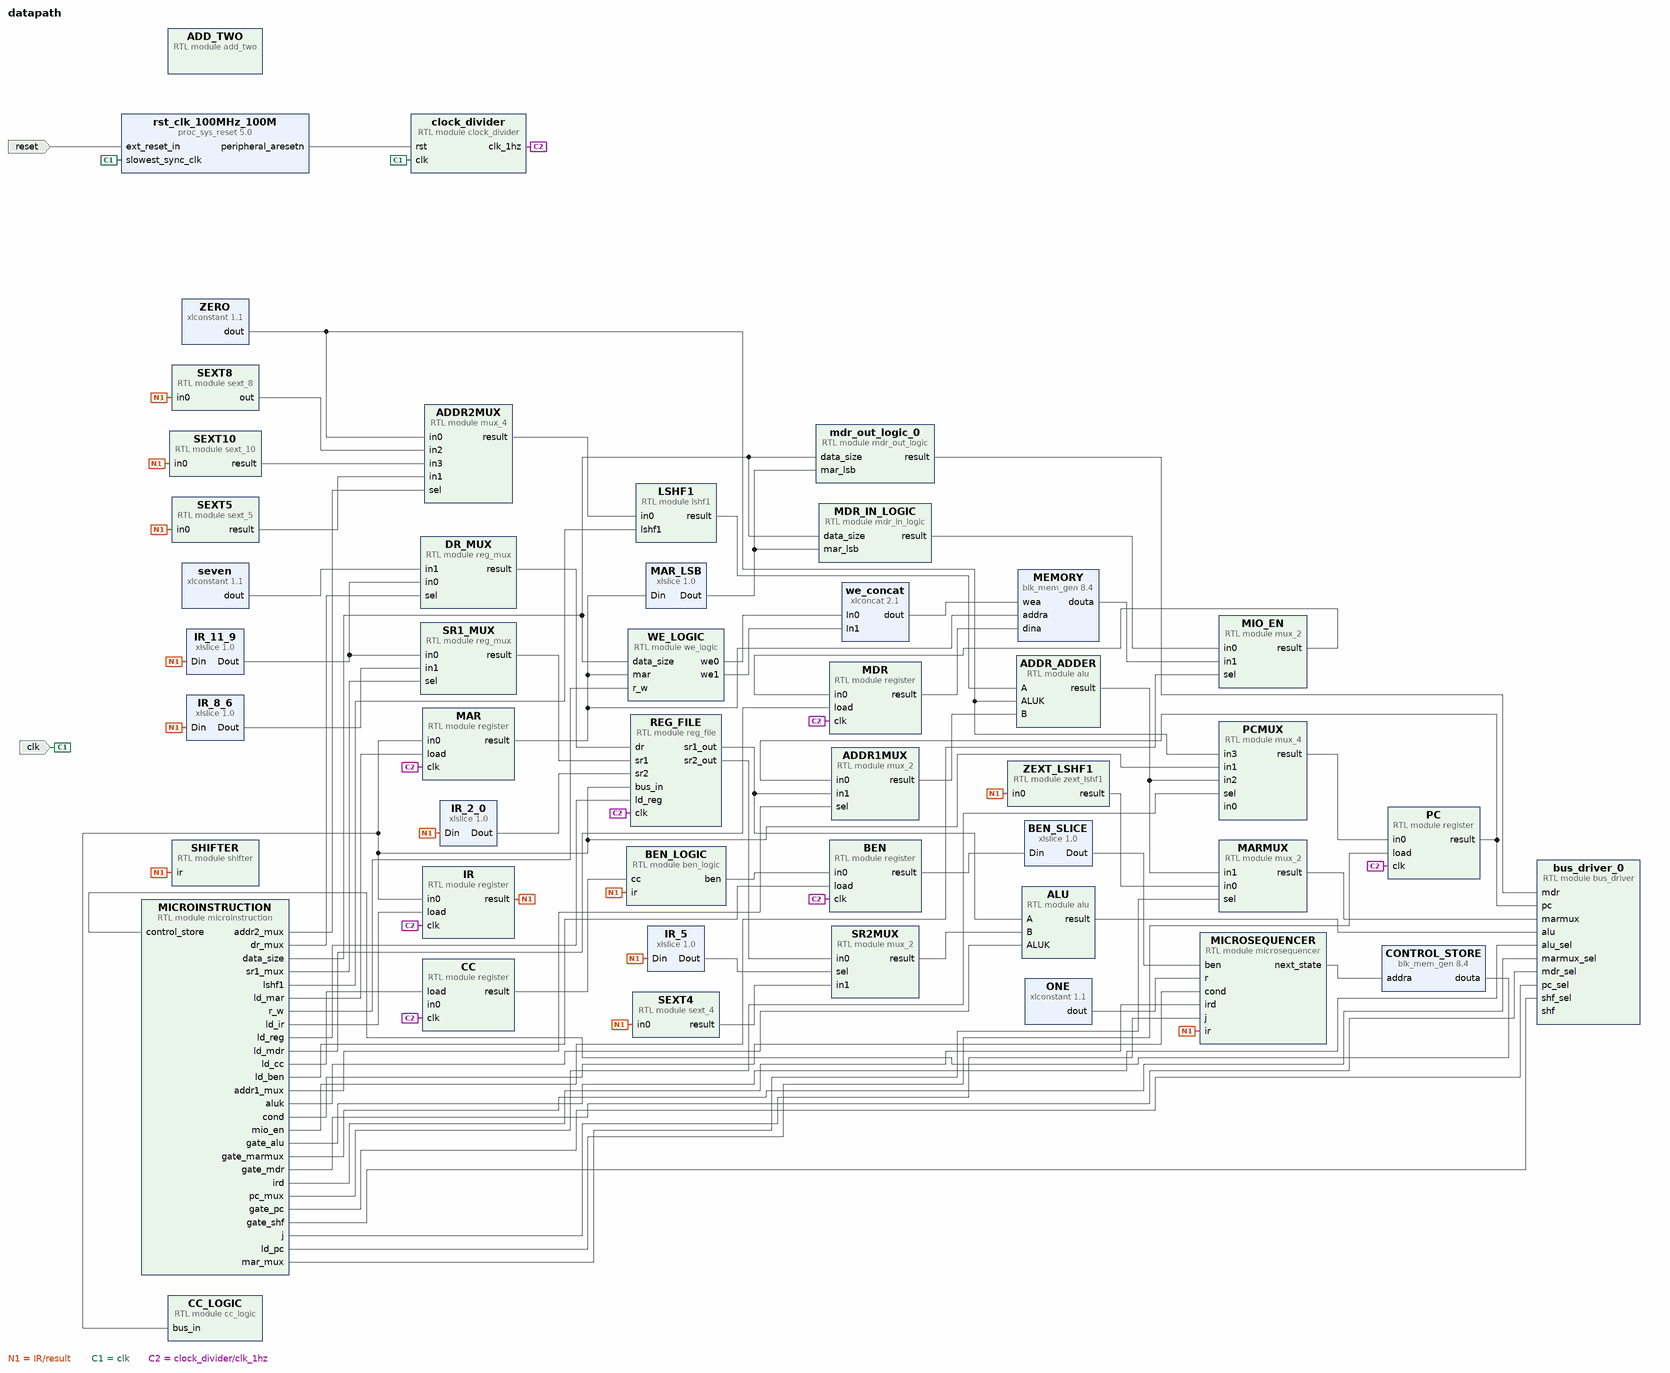
[diagram p0: block diagram of the top level]
# Vivado block design datapath, xc7a35tcpg236-1, Vivado 2021.1
create_bd_design datapath

create_bd_port -dir I -type clk clk
set_property -dict {CONFIG.FREQ_HZ 100000000} [get_bd_ports clk]
create_bd_port -dir I -type rst reset
set_property -dict {CONFIG.POLARITY ACTIVE_LOW} [get_bd_ports reset]

create_bd_cell -type module -reference alu ALU
create_bd_cell -type module -reference mux_2 SR2MUX
create_bd_cell -type module -reference reg_file REG_FILE
create_bd_cell -type module -reference sext_4 SEXT4
create_bd_cell -type module -reference register IR
create_bd_cell -type module -reference zext_lshf1 ZEXT_LSHF1
create_bd_cell -type module -reference mux_2 MARMUX
create_bd_cell -type module -reference alu ADDR_ADDER
create_bd_cell -type ip -vlnv xilinx.com:ip:xlconstant:1.1 ZERO
set_property -dict {CONFIG.CONST_VAL 0 CONFIG.CONST_WIDTH 15} [get_bd_cells ZERO]
create_bd_cell -type module -reference sext_8 SEXT8
create_bd_cell -type module -reference mux_2 ADDR1MUX
create_bd_cell -type module -reference register PC
create_bd_cell -type module -reference register CC
create_bd_cell -type module -reference mux_2 MIO_EN
create_bd_cell -type module -reference register MDR
create_bd_cell -type module -reference register MAR
create_bd_cell -type ip -vlnv xilinx.com:ip:blk_mem_gen:8.4 MEMORY
set_property -dict [list \
  CONFIG.Byte_Size 8 \
  CONFIG.Enable_32bit_Address false \
  CONFIG.Enable_A Always_Enabled \
  CONFIG.Read_Width_A 16 \
  CONFIG.Register_PortA_Output_of_Memory_Primitives true \
  CONFIG.Use_Byte_Write_Enable true \
  CONFIG.Use_RSTA_Pin false \
  CONFIG.Write_Depth_A 65536 \
  CONFIG.Write_Width_A 16 \
  CONFIG.use_bram_block Stand_Alone \
] [get_bd_cells MEMORY]
create_bd_cell -type module -reference we_logic WE_LOGIC
create_bd_cell -type ip -vlnv xilinx.com:ip:xlconcat:2.1 we_concat
create_bd_cell -type module -reference microsequencer MICROSEQUENCER
create_bd_cell -type ip -vlnv xilinx.com:ip:blk_mem_gen:8.4 CONTROL_STORE
set_property -dict [list \
  CONFIG.Enable_32bit_Address false \
  CONFIG.Enable_A Always_Enabled \
  CONFIG.Memory_Type Single_Port_ROM \
  CONFIG.Port_A_Write_Rate 0 \
  CONFIG.Register_PortA_Output_of_Memory_Primitives true \
  CONFIG.Use_RSTA_Pin false \
  CONFIG.Write_Depth_A 63 \
  CONFIG.Write_Width_A 35 \
  CONFIG.use_bram_block Stand_Alone \
] [get_bd_cells CONTROL_STORE]
create_bd_cell -type module -reference microinstruction MICROINSTRUCTION
create_bd_cell -type module -reference mux_4 ADDR2MUX
create_bd_cell -type module -reference mux_4 PCMUX
create_bd_cell -type module -reference reg_mux DR_MUX
create_bd_cell -type ip -vlnv xilinx.com:ip:xlslice:1.0 IR_11_9
set_property -dict {CONFIG.DIN_FROM 11 CONFIG.DIN_TO 9 CONFIG.DIN_WIDTH 16 CONFIG.DOUT_WIDTH 3} [get_bd_cells IR_11_9]
create_bd_cell -type ip -vlnv xilinx.com:ip:xlconstant:1.1 seven
set_property -dict {CONFIG.CONST_VAL 7 CONFIG.CONST_WIDTH 3} [get_bd_cells seven]
create_bd_cell -type module -reference reg_mux SR1_MUX
create_bd_cell -type ip -vlnv xilinx.com:ip:xlslice:1.0 IR_8_6
set_property -dict {CONFIG.DIN_FROM 8 CONFIG.DIN_TO 6 CONFIG.DIN_WIDTH 16 CONFIG.DOUT_WIDTH 3} [get_bd_cells IR_8_6]
create_bd_cell -type ip -vlnv xilinx.com:ip:xlconstant:1.1 ONE
create_bd_cell -type module -reference ben_logic BEN_LOGIC
create_bd_cell -type module -reference register BEN
create_bd_cell -type ip -vlnv xilinx.com:ip:xlslice:1.0 BEN_SLICE
set_property -dict {CONFIG.DIN_WIDTH 16} [get_bd_cells BEN_SLICE]
create_bd_cell -type module -reference clock_divider clock_divider
create_bd_cell -type ip -vlnv xilinx.com:ip:xlslice:1.0 MAR_LSB
set_property -dict {CONFIG.DIN_WIDTH 16} [get_bd_cells MAR_LSB]
create_bd_cell -type ip -vlnv xilinx.com:ip:proc_sys_reset:5.0 rst_clk_100MHz_100M
create_bd_cell -type ip -vlnv xilinx.com:ip:xlslice:1.0 IR_5
set_property -dict {CONFIG.DIN_FROM 5 CONFIG.DIN_TO 5 CONFIG.DIN_WIDTH 16 CONFIG.DOUT_WIDTH 1} [get_bd_cells IR_5]
create_bd_cell -type ip -vlnv xilinx.com:ip:xlslice:1.0 IR_2_0
set_property -dict {CONFIG.DIN_FROM 2 CONFIG.DIN_WIDTH 16 CONFIG.DOUT_WIDTH 3} [get_bd_cells IR_2_0]
create_bd_cell -type module -reference sext_10 SEXT10
create_bd_cell -type module -reference lshf1 LSHF1
create_bd_cell -type module -reference add_two ADD_TWO
create_bd_cell -type module -reference cc_logic CC_LOGIC
create_bd_cell -type module -reference shifter SHIFTER
create_bd_cell -type module -reference bus_driver bus_driver_0
create_bd_cell -type module -reference mdr_out_logic mdr_out_logic_0
create_bd_cell -type module -reference mdr_in_logic MDR_IN_LOGIC
create_bd_cell -type module -reference sext_5 SEXT5

# ---- connections ----

connect_bd_net [get_bd_pins ADDR2MUX/result] [get_bd_pins LSHF1/in0]
connect_bd_net [get_bd_pins ADDR_ADDER/result] [get_bd_pins MARMUX/in1] [get_bd_pins PCMUX/in2]
# net ADD_TWO_out has one end: PCMUX/in0
connect_bd_net [get_bd_pins ALU/result] [get_bd_pins bus_driver_0/alu]
connect_bd_net [get_bd_pins BEN_LOGIC/ben] [get_bd_pins BEN/in0]
connect_bd_net [get_bd_pins BEN_SLICE/Dout] [get_bd_pins MICROSEQUENCER/ben]
connect_bd_net [get_bd_pins BEN/result] [get_bd_pins BEN_SLICE/Din]
connect_bd_net [get_bd_pins CC/result] [get_bd_pins BEN_LOGIC/cc]
connect_bd_net [get_bd_pins CONTROL_STORE/douta] [get_bd_pins MICROINSTRUCTION/control_store]
connect_bd_net [get_bd_pins DR_MUX/result] [get_bd_pins REG_FILE/dr]
connect_bd_net -net IR_11_10_Dout [get_bd_pins IR_8_6/Dout] [get_bd_pins SR1_MUX/in1]
connect_bd_net [get_bd_pins IR_2_0/Dout] [get_bd_pins REG_FILE/sr2]
connect_bd_net [get_bd_pins IR_5/Dout] [get_bd_pins SR2MUX/sel]
connect_bd_net [get_bd_pins IR/result] \
  [get_bd_pins SEXT4/in0] [get_bd_pins ZEXT_LSHF1/in0] [get_bd_pins SEXT8/in0] [get_bd_pins MICROSEQUENCER/ir] \
  [get_bd_pins IR_11_9/Din] [get_bd_pins IR_8_6/Din] [get_bd_pins BEN_LOGIC/ir] [get_bd_pins IR_5/Din] \
  [get_bd_pins IR_2_0/Din] [get_bd_pins SEXT10/in0] [get_bd_pins SHIFTER/ir] [get_bd_pins SEXT5/in0]
connect_bd_net [get_bd_pins MARMUX/result] [get_bd_pins bus_driver_0/marmux]
connect_bd_net [get_bd_pins MAR/result] [get_bd_pins WE_LOGIC/mar] [get_bd_pins MEMORY/addra] [get_bd_pins MAR_LSB/Din]
connect_bd_net [get_bd_pins MDR_IN_LOGIC/result] [get_bd_pins MIO_EN/in0]
connect_bd_net [get_bd_pins MDR/result] [get_bd_pins MEMORY/dina]
connect_bd_net [get_bd_pins MEMORY/douta] [get_bd_pins MIO_EN/in1]
connect_bd_net [get_bd_pins MICROINSTRUCTION/addr1_mux] [get_bd_pins ADDR1MUX/sel]
connect_bd_net [get_bd_pins MICROINSTRUCTION/addr2_mux] [get_bd_pins ADDR2MUX/sel]
connect_bd_net [get_bd_pins MICROINSTRUCTION/aluk] [get_bd_pins ALU/ALUK]
connect_bd_net [get_bd_pins MICROINSTRUCTION/cond] [get_bd_pins MICROSEQUENCER/cond]
connect_bd_net [get_bd_pins MICROINSTRUCTION/data_size] \
  [get_bd_pins WE_LOGIC/data_size] [get_bd_pins mdr_out_logic_0/data_size] [get_bd_pins MDR_IN_LOGIC/data_size]
connect_bd_net [get_bd_pins MICROINSTRUCTION/dr_mux] [get_bd_pins DR_MUX/sel]
connect_bd_net [get_bd_pins MICROINSTRUCTION/gate_alu] [get_bd_pins bus_driver_0/alu_sel]
connect_bd_net [get_bd_pins MICROINSTRUCTION/gate_marmux] [get_bd_pins bus_driver_0/marmux_sel]
connect_bd_net [get_bd_pins MICROINSTRUCTION/gate_mdr] [get_bd_pins bus_driver_0/mdr_sel]
connect_bd_net [get_bd_pins MICROINSTRUCTION/gate_pc] [get_bd_pins bus_driver_0/pc_sel]
connect_bd_net [get_bd_pins MICROINSTRUCTION/gate_shf] [get_bd_pins bus_driver_0/shf_sel]
connect_bd_net [get_bd_pins MICROINSTRUCTION/ird] [get_bd_pins MICROSEQUENCER/ird]
connect_bd_net [get_bd_pins MICROINSTRUCTION/j] [get_bd_pins MICROSEQUENCER/j]
connect_bd_net [get_bd_pins MICROINSTRUCTION/ld_ben] [get_bd_pins BEN/load]
connect_bd_net [get_bd_pins MICROINSTRUCTION/ld_cc] [get_bd_pins CC/load]
connect_bd_net [get_bd_pins MICROINSTRUCTION/ld_ir] [get_bd_pins IR/load]
connect_bd_net [get_bd_pins MICROINSTRUCTION/ld_mar] [get_bd_pins MAR/load]
connect_bd_net [get_bd_pins MICROINSTRUCTION/ld_mdr] [get_bd_pins MDR/load]
connect_bd_net [get_bd_pins MICROINSTRUCTION/ld_pc] [get_bd_pins PC/load]
connect_bd_net [get_bd_pins MICROINSTRUCTION/ld_reg] [get_bd_pins REG_FILE/ld_reg]
connect_bd_net [get_bd_pins MICROINSTRUCTION/lshf1] [get_bd_pins LSHF1/lshf1]
connect_bd_net [get_bd_pins MICROINSTRUCTION/mar_mux] [get_bd_pins MARMUX/sel]
connect_bd_net [get_bd_pins MICROINSTRUCTION/mio_en] [get_bd_pins MIO_EN/sel]
connect_bd_net [get_bd_pins MICROINSTRUCTION/pc_mux] [get_bd_pins PCMUX/sel]
connect_bd_net [get_bd_pins MICROINSTRUCTION/r_w] [get_bd_pins WE_LOGIC/r_w]
connect_bd_net [get_bd_pins MICROINSTRUCTION/sr1_mux] [get_bd_pins SR1_MUX/sel]
connect_bd_net [get_bd_pins MIO_EN/result] [get_bd_pins MDR/in0]
connect_bd_net [get_bd_pins IR/in0] [get_bd_pins REG_FILE/bus_in] [get_bd_pins MAR/in0] [get_bd_pins PCMUX/in1] [get_bd_pins CC_LOGIC/bus_in]
connect_bd_net [get_bd_pins PCMUX/result] [get_bd_pins PC/in0]
connect_bd_net [get_bd_pins PC/result] [get_bd_pins ADDR1MUX/in0] [get_bd_pins bus_driver_0/pc]
connect_bd_net [get_bd_pins REG_FILE/sr2_out] [get_bd_pins SR2MUX/in0]
connect_bd_net [get_bd_pins SEXT4/result] [get_bd_pins SR2MUX/in1]
connect_bd_net [get_bd_pins SEXT8/out] [get_bd_pins ADDR2MUX/in2]
# net SHIFTER_out has one end: bus_driver_0/shf
connect_bd_net [get_bd_pins SR1_MUX/result] [get_bd_pins REG_FILE/sr1]
connect_bd_net [get_bd_pins SR2MUX/result] [get_bd_pins ALU/B]
connect_bd_net [get_bd_pins WE_LOGIC/we0] [get_bd_pins we_concat/In0]
connect_bd_net [get_bd_pins WE_LOGIC/we1] [get_bd_pins we_concat/In1]
connect_bd_net [get_bd_pins ZEXT_LSHF1/result] [get_bd_pins MARMUX/in0]
# net cc_logic_0_out has one end: CC/in0
connect_bd_net -net clk_100MHz_1 [get_bd_ports clk] [get_bd_pins clock_divider/clk] [get_bd_pins rst_clk_100MHz_100M/slowest_sync_clk]
connect_bd_net [get_bd_pins clock_divider/clk_1hz] \
  [get_bd_pins PC/clk] [get_bd_pins REG_FILE/clk] [get_bd_pins BEN/clk] [get_bd_pins MDR/clk] [get_bd_pins MAR/clk] \
  [get_bd_pins IR/clk] [get_bd_pins CC/clk]
connect_bd_net -net lshf1_0_out [get_bd_pins LSHF1/result] [get_bd_pins ADDR_ADDER/A]
connect_bd_net [get_bd_pins mdr_out_logic_0/result] [get_bd_pins bus_driver_0/mdr]
connect_bd_net -net microsequencer_0_next_state [get_bd_pins MICROSEQUENCER/next_state] [get_bd_pins CONTROL_STORE/addra]
connect_bd_net -net mux_2_0_result [get_bd_pins ADDR1MUX/result] [get_bd_pins ADDR_ADDER/B]
connect_bd_net -net reg_file_0_sr1_out [get_bd_pins REG_FILE/sr1_out] [get_bd_pins ALU/A] [get_bd_pins ADDR1MUX/in1]
connect_bd_net -net reset_rtl_0_1 [get_bd_ports reset] [get_bd_pins rst_clk_100MHz_100M/ext_reset_in]
connect_bd_net [get_bd_pins rst_clk_100MHz_100M/peripheral_aresetn] [get_bd_pins clock_divider/rst]
connect_bd_net [get_bd_pins seven/dout] [get_bd_pins DR_MUX/in1]
connect_bd_net -net sext_10_0_out [get_bd_pins SEXT10/result] [get_bd_pins ADDR2MUX/in3]
connect_bd_net -net sext_5_0_out [get_bd_pins SEXT5/result] [get_bd_pins ADDR2MUX/in1]
connect_bd_net -net xlconcat_0_dout [get_bd_pins we_concat/dout] [get_bd_pins MEMORY/wea]
connect_bd_net -net xlconstant_0_dout [get_bd_pins ZERO/dout] [get_bd_pins ADDR_ADDER/ALUK] [get_bd_pins ADDR2MUX/in0] [get_bd_pins PCMUX/in3]
connect_bd_net -net xlconstant_0_dout1 [get_bd_pins ONE/dout] [get_bd_pins MICROSEQUENCER/r]
connect_bd_net -net xlslice_0_Dout [get_bd_pins IR_11_9/Dout] [get_bd_pins DR_MUX/in0] [get_bd_pins SR1_MUX/in0]
connect_bd_net -net xlslice_0_Dout1 [get_bd_pins MAR_LSB/Dout] [get_bd_pins mdr_out_logic_0/mar_lsb] [get_bd_pins MDR_IN_LOGIC/mar_lsb]

validate_bd_design
save_bd_design
